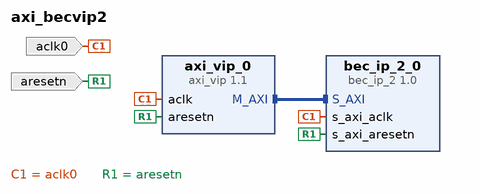
[diagram p0: block diagram of the top level]
# Vivado block design axi_becvip2, xc7z020clg400-1, Vivado 2022.2
create_bd_design axi_becvip2

create_bd_port -dir I aclk0
create_bd_port -dir I aresetn

create_bd_cell -type ip -vlnv xilinx.com:ip:axi_vip:1.1 axi_vip_0
set_property -dict [list \
  CONFIG.ADDR_WIDTH 32 \
  CONFIG.DATA_WIDTH 32 \
  CONFIG.HAS_BRESP 1 \
  CONFIG.HAS_PROT 1 \
  CONFIG.HAS_RRESP 1 \
  CONFIG.HAS_WSTRB 1 \
  CONFIG.INTERFACE_MODE MASTER \
  CONFIG.PROTOCOL AXI4LITE \
  CONFIG.READ_WRITE_MODE READ_WRITE \
] [get_bd_cells axi_vip_0]
create_bd_cell -type ip -vlnv xilinx.com:user:bec_ip_2:1.0 bec_ip_2_0

# ---- connections ----

connect_bd_intf_net [get_bd_intf_pins bec_ip_2_0/S_AXI] [get_bd_intf_pins axi_vip_0/M_AXI]
connect_bd_net [get_bd_ports aclk0] [get_bd_pins axi_vip_0/aclk] [get_bd_pins bec_ip_2_0/s_axi_aclk]
connect_bd_net [get_bd_ports aresetn] [get_bd_pins axi_vip_0/aresetn] [get_bd_pins bec_ip_2_0/s_axi_aresetn]

# ---- address map ----
assign_bd_address -offset 0xC0000000 -range 64K -target_address_space [get_bd_addr_spaces axi_vip_0/Master_AXI] [get_bd_addr_segs bec_ip_2_0/S_AXI/S_AXI_reg]

validate_bd_design
save_bd_design
